# EAGLE design Zio Qwiic Triple Axis Magnetometer MLX90393 (EAGLE 9.1.1)
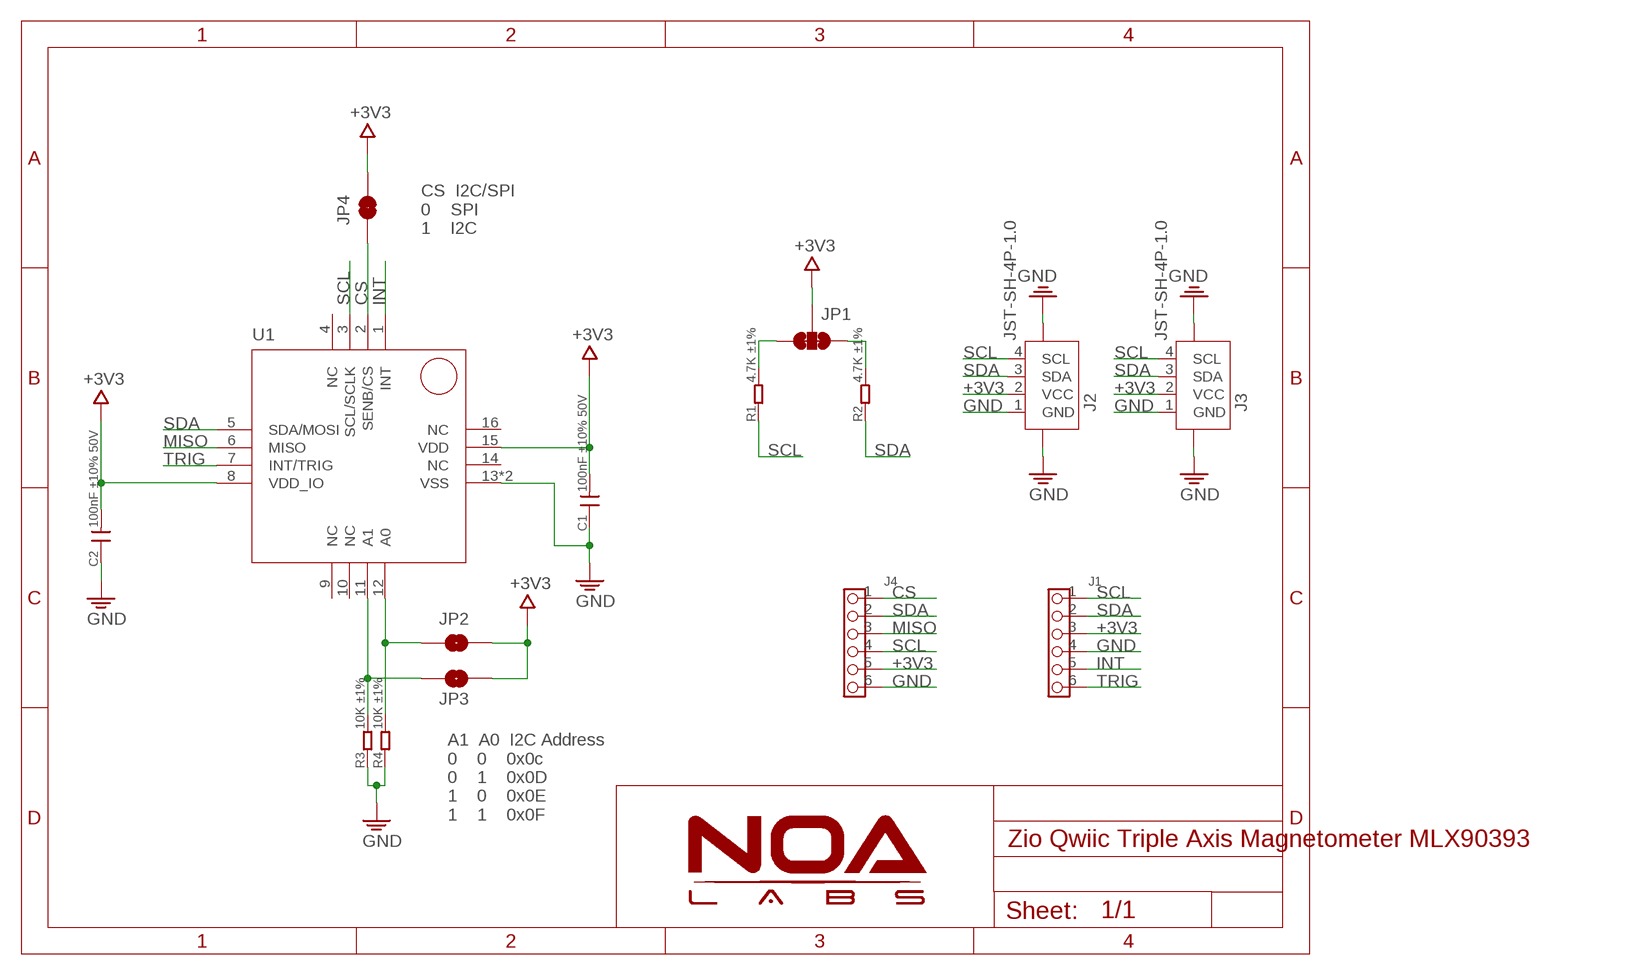
[diagram p0: schematic, sheet 1]

## Parts
C1  100nF ±10% 50V  C-0603  [C0603]
C2  100nF ±10% 50V  C-0603  [C0603]
J1  HEADER-6P-60/35MIL  [6P-2.54-60/35MIL]
J2  JST-SH-4P-1.0  [JST-SH-4P]
J3  JST-SH-4P-1.0  [JST-SH-4P]
J4  HEADER-6P-60/35MIL  [6P-2.54-60/35MIL]
JP1  SMT-JUMPER_3_2-NC_TRACE  [SMT-JUMPER_3_2-NC_TRACE]
JP2  JUMPER-SMT_2_NC_PASTE_NOCREM  [SMT-JUMPER_2_NC_PASTE_SILK_NOCREM]
JP3  JUMPER-SMT_2_NC_PASTE_NOCREM  [SMT-JUMPER_2_NC_PASTE_SILK_NOCREM]
JP4  JUMPER-SMT_2_NC_TRACE  [SMT-JUMPER_2_NC_TRACE]
R1  4.7K ±1%  R-0603  [R0603]
R2  4.7K ±1%  R-0603  [R0603]
R3  10K ±1%  R-0603  [R0603]
R4  10K ±1%  R-0603  [R0603]
U1  MLX90393  [QFN16-3*3]

## Nets
+3V3: C1.2 C2.2 J1.3 J2.2(VCC) J3.2(VCC) J4.5 JP1.2 JP2.2 JP3.2 JP4.2 U1.8(VDD_IO) U1.15(VDD)
CS: J4.1 JP4.1 U1.2(SENB/CS)
GND: C1.1 C2.1 J1.4 J2.1(GND) J2.NC1 J2.NC2 J3.1(GND) J3.NC1 J3.NC2 J4.6 R3.1 R4.1 U1.13(VSS) U1.PAD(VSS)
INT: J1.5 U1.1(INT)
MISO: J4.3 U1.6(MISO)
N$1: JP3.1 R3.2 U1.11(A1)
N$2: JP2.1 R4.2 U1.12(A0)
N$6: JP1.3 R1.2
N$8: JP1.1 R2.2
SCL: J1.1 J2.4(SCL) J3.4(SCL) J4.4 R1.1 U1.3(SCL/SCLK)
SDA: J1.2 J2.3(SDA) J3.3(SDA) J4.2 R2.1 U1.5(SDA/MOSI)
TRIG: J1.6 U1.7(INT/TRIG)
Unconnected: U1.4(NC) U1.9(NC) U1.10(NC) U1.14(NC) U1.16(NC)

## Notes on the sheet
- CS  I2C/SPI
  0    SPI
  1    I2C
- A1  A0  I2C Address
  0    0    0x0c
  0    1    0x0D
  1    0    0x0E
  1    1    0x0F

## Library data of the parts
C1 C2 = RCL:C
J1 J4 = Connector_NOA:HEADER-6P
J2 J3 = Connector:JST-SH-4P
JP1 = NOA-Jumpers:SMT-JUMPER_3_2-NC_TRACE
JP2 JP3 = NOA-Jumpers:JUMPER-SMT_2_NC_PASTE_NOCREM
JP4 = NOA-Jumpers:JUMPER-SMT_2_NC_TRACE
R1-R4 = RCL:R
U1 = IC:MLX90393

## Board
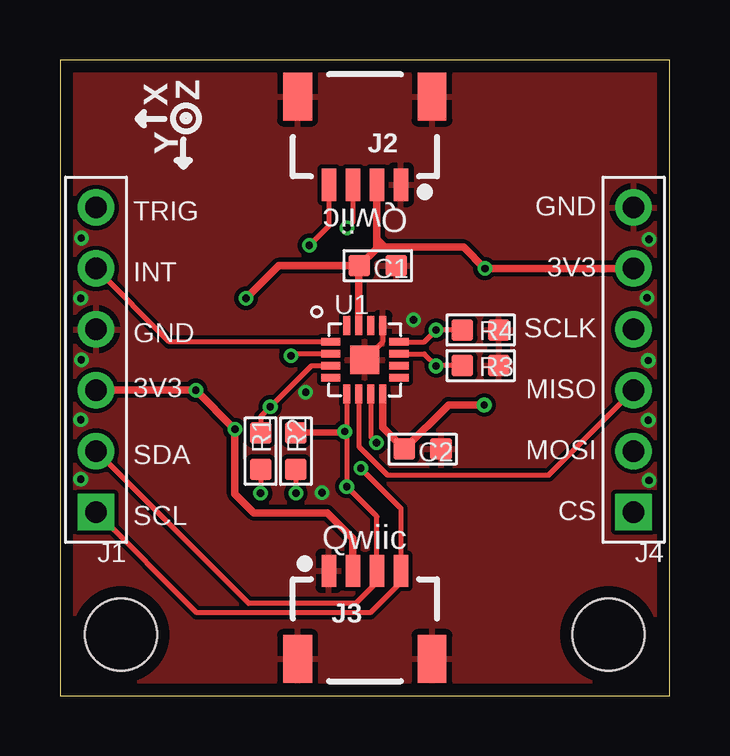
[diagram p1: board, top side]
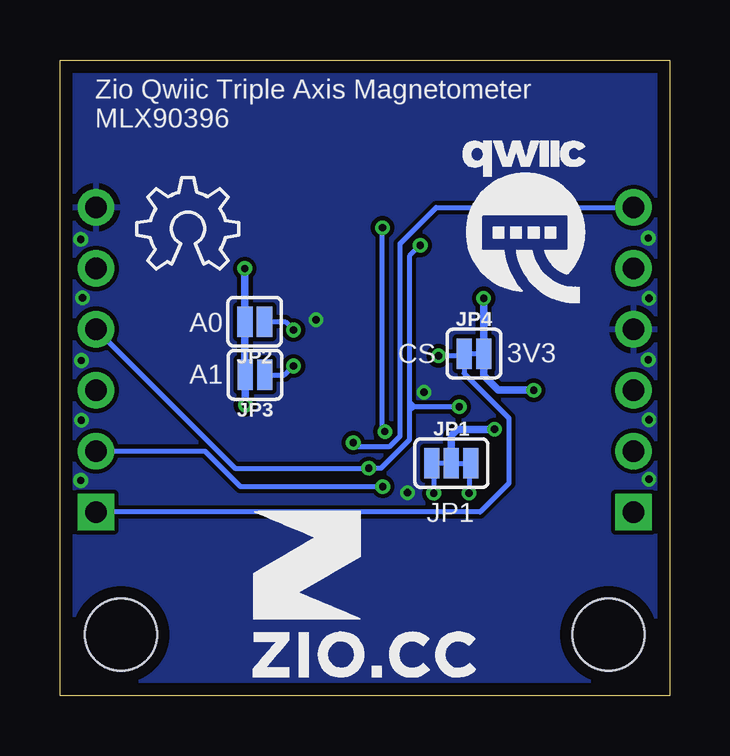
[diagram p2: board, bottom side, seen from below]

Size 25.4 x 26.5 mm. Coordinates in mm from the lower left corner, seen from the top.
Outline: 0,0 25.4,0 25.4,26.5 0,26.5 0,0
Copper layers (1*16): Top 0.035mm / dielectric 1.5mm / Bottom 0.035mm
Design rules "NOA Eagle Rule": minimum track width 7mil, minimum drill 12mil, track to track 7mil, track to pad 7mil, pad to pad 7mil, via to via 7mil, smd to smd 0mil, copper to edge 20mil, drill to drill 10mil, minimum pad ring 10mil, minimum via ring 6mil, stop-mask expansion 2mil, vias tented up to drill 25mil, thermal gap 10mil
Holes 3 mm at 2.54,2.54 22.86,2.54

### Footprints (pad centres in the part's own frame; a part is rotated, then mirrored left to right if it is on the bottom)
C0603 = smd 0.889 x 0.889: 1 -0.762,0; 2 0.762,0
6P-2.54-60/35MIL = drill 0.889 pad 1.524 square: 1 0,6.35 | drill 0.889 pad 1.524: 2 0,3.81; 3 0,1.27; 4 0,-1.27; 5 0,-3.81; 6 0,-6.35
JST-SH-4P = smd 0.6 x 1.35: 1 1.5,0; 2 0.5,0; 3 -0.5,0; 4 -1.5,0 | smd 1.2 x 2: NC1 -2.8,3.675; NC2 2.8,3.675
SMT-JUMPER_3_2-NC_TRACE = smd 0.635 x 1.27: 1 -0.813,0; 2 0,0; 3 0.813,0
SMT-JUMPER_2_NC_PASTE_SILK_NOCREM = smd 0.635 x 1.27: 1 -0.406,0; 2 0.406,0
SMT-JUMPER_2_NC_TRACE = smd 0.635 x 1.27: 1 -0.406,0; 2 0.406,0
R0603 = smd 0.889 x 0.889: 1 -0.762,0; 2 0.762,0
QFN16-3*3 = smd 0.8 x 0.3: 1 -1.425,0.75; 2 -1.425,0.25; 3 -1.425,-0.25; 4 -1.425,-0.75; 9 1.425,-0.75; 10 1.425,-0.25; 11 1.425,0.25; 12 1.425,0.75 | smd 0.3 x 0.8: 5 -0.75,-1.425; 6 -0.25,-1.425; 7 0.25,-1.425; 8 0.75,-1.425; 13 0.75,1.425; 14 0.25,1.425; 15 -0.25,1.425; 16 -0.75,1.425 | smd 1.2 x 1.2: PAD 0,0

### Placement (x,y rotation side)
C1  13.24,17.92 180 top
C2  15.11,10.27 180 top
J1  1.5,14 180 top
J2  12.7,21.3 0 top
J3  12.7,5.2 180 top
J4  23.9,14 180 top
JP1  9.09,9.69 0 bottom
JP2  17.29,15.59 180 bottom
JP3  17.27,13.37 180 bottom
JP4  8.15,14.26 0 bottom
R1  8.36,10.19 270 top
R2  9.83,10.19 270 top
R3  17.53,13.75 180 top
R4  17.53,15.25 180 top
U1  12.7,14 0 top
U$6  [7MM]  17.37,0.79 0 bottom
U$7  [QWIIC-LOGO-MEDIUM]  6.07,19.81 0 bottom
U$8  [OSHW_6X150_NOTEXT]  22.2,17.78 0 bottom

### Tracks (layer width: path | path; a pad name or v marks a point on that pad's centre or on a via)
+3V3  (via drill 0.3)
  Top 0.305: U1.8 13.45,11.17 C2.2 16.2,12.12 v17.68,12.12 | U1.15 12.45,17.89 C1.2 | J1.3 v5.66,12.73 v7.29,11.1 7.29,8.41 8.08,7.62 11.12,7.62 12.2,6.54 J3.2 | J2.2 13.2,19.05 | 13.2,19.05 13.2,18.69 | 13.2,18.69 13.2,18.64 C1.2 | J4.5 v17.71,17.81 v17.7,17.8 16.82,18.69 13.54,18.69 | 13.54,18.69 13.2,18.69 | 13.54,18.69 13.2,19.03 13.2,19.05 | C1.2 9.1,17.92 v7.75,16.56
  Bottom 0.305: JP1.2 9.09,10.85 8.84,11.1 v7.29,11.1 | v17.7,17.8 17.7,17.8 JP2.2 17.7,13.39 JP3.2 v17.68,12.12 | v7.75,16.56 JP4.2 7.75,13.34 7.14,12.73 v5.66,12.73
CS  (via drill 0.3)
  Top 0.203: U1.2 9.71,14.25 v9.63,14.17
  Bottom 0.203: v9.63,14.17 8.65,14.17 JP4.1 8.56,13.44 6.69,11.57 6.69,8.85 7.89,7.65 J4.1
GND  (via drill 0.3)
  Top 0.203: U1.13 13.45,15.02 13.45,14.75 U1.PAD
  other vias: 24.54,8.97 24.51,11.48 24.51,13.97 24.46,16.59 24.54,19.02 10.92,8.46 0.86,9.02 0.86,11.51 0.89,14 0.86,16.56 0.89,19.08 14.73,15.67 10.24,12.65
  pour Top: 0,26.49 25.43,26.49 25.43,0 0,0
  pour Bottom: 0,26.49 25.43,26.49 25.43,0 0,0
INT
  Top 0.203: U1.1 4.56,14.75 J1.5
MISO
  Top 0.203: U1.6 12.45,10.38 13.64,9.2 20.36,9.2 J4.3
N$1  (via drill 0.3)
  Top 0.203: R3.2 v15.68,13.75 | v15.68,13.75 v15.67,13.74 | U1.11 15.18,14.25 v15.68,13.75
  Bottom 0.203: JP3.1 16.04,13.37 v15.67,13.74
N$2  (via drill 0.3)
  Top 0.203: R4.2 v15.68,15.25 v15.67,15.24 15.18,14.75 U1.12
  Bottom 0.203: JP2.1 16.02,15.59 v15.67,15.24
N$6  (via drill 0.3)
  Top 0.203: R1.2 v8.36,8.43
  Bottom 0.203: JP1.3 8.36,9.61 v8.36,8.43
N$8  (via drill 0.3)
  Top 0.203: R2.2 v9.83,8.43
  Bottom 0.203: JP1.1 9.83,9.61 v9.83,8.43
SCL  (via drill 0.3)
  Top 0.203: U1.3 10.47,13.75 v8.76,12.04 8.36,11.63 R1.1 | J1.1 5.7,3.45 12.93,3.45 14.2,4.73 J3.4 14.2,7.81 v12.53,9.47 | J2.4 11.2,19.58 v10.39,18.77
  Bottom 0.203: J4.4 18.1,9.47 v12.53,9.47 12.03,9.47 10.85,10.66 10.85,11.86 | v10.39,18.77 10.85,18.31 10.85,12.24 | 10.85,12.24 10.85,11.86 | 10.64,12.04 10.85,12.24 | v8.76,12.04 10.64,12.04 | 10.64,12.04 10.67,12.04 10.85,11.86
SDA  (via drill 0.3)
  Top 0.203: U1.5 11.95,11.23 | 11.95,11.23 11.95,11.05 11.95,10.87 11.95,10.77 | 11.95,10.77 v11.95,8.71 13.2,7.46 J3.3 13.2,4.72 12.32,3.83 7.86,3.83 J1.2 | J2.3 12.2,19.74 v11.96,19.51 | R2.1 9.86,10.99 | 9.86,10.99 9.92,11.05 9.86,10.99 | R2.1 11.76,10.96 | 11.76,10.96 11.95,10.77 | 11.76,10.96 11.95,11.14 11.95,11.23 | R2.1 9.88,11.01 v11.87,11.01
  Bottom 0.203: v11.96,19.51 11.96,11.15 11.87,11.05 v11.87,11.01 | J4.2 19.36,10.19 17.88,8.71 v11.95,8.71
TRIG  (via drill 0.3)
  Top 0.203: U1.7 12.95,10.77 v13.18,10.54
  Bottom 0.203: v13.18,10.54 13.03,10.39 11.66,10.39 11.23,10.82 11.23,18.85 9.72,20.35 J1.6

### Text on the board
tPlace: X | Z | Y | GND | TRIG | Qwiic | 3V3 | INT | SCLK | GND | MISO | 3V3 | MOSI | SDA | CS | SCL | Qwiic
bPlace: Zio Qwiic Triple Axis Magnetometer / MLX90396 | A0 | 3V3 | CS | A1 | JP1